# Altium schematic sheet Logic Buffer.SchDoc
size A; SheetNumber: 10; SheetTotal: 12
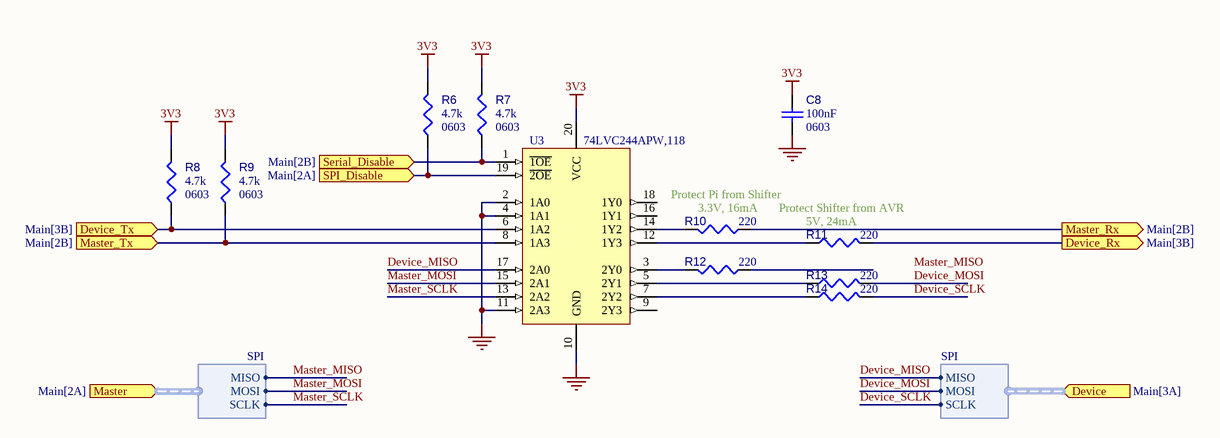
[diagram p0: Logic Buffer.SchDoc]

## Parts
C8  value 100nF  Case/Package: 0603  [CAPC1608X90X40NL10T20]  (hidden comment: Capacitor 100 nF +/-10% 50 V 0603)
R6  value 4.7k  Case/Package: 0603  [RESC1608X55X25ML10T15]  (hidden comment: Resistor 1k +/-1% 0603 100 mW)
R7  value 4.7k  Case/Package: 0603  [RESC1608X55X25ML10T15]  (hidden comment: Resistor 1k +/-1% 0603 100 mW)
R8  value 4.7k  Case/Package: 0603  [RESC1608X55X25ML10T15]  (hidden comment: Resistor 1k +/-1% 0603 100 mW)
R9  value 4.7k  Case/Package: 0603  [RESC1608X55X25ML10T15]  (hidden comment: Resistor 1k +/-1% 0603 100 mW)
R10  value 220  [RESC1608X55X25ML10T15]  (hidden comment: Resistor 1k +/-1% 0603 100 mW)
R11  value 220  [RESC0603(1608)_L]  (hidden comment: Resistor 120R +/-5 % 0603 0.1 W)
R12  value 220  [RESC1608X55X25ML10T15]  (hidden comment: Resistor 1k +/-1% 0603 100 mW)
R13  value 220  [RESC0603(1608)_L]  (hidden comment: Resistor 120R +/-5 % 0603 0.1 W)
R14  value 220  [RESC0603(1608)_L]  (hidden comment: Resistor 120R +/-5 % 0603 0.1 W)
U3  74LVC244APW,118  [SOP65P640X110-20N]

## Ports
Device (in, harness SPI, see Main[3A]), Device_Rx (out, see Main[3B]), Device_Tx (in, see Main[3B]), Master (in, harness SPI, see Main[2A]), Master_Rx (out, see Main[2B]), Master_Tx (in, see Main[2B]), Serial_Disable (in, see Main[2B]), SPI_Disable (in, see Main[2A])

## Harnesses
SPI: MISO, MOSI, SCLK

## Nets
3V3: C8.2 R6.2 R7.2 R8.2 R9.2 U3.20(VCC)
GND: C8.1 U3.2(1A0) U3.4(1A1) U3.10(GND) U3.11(2A3)
Device_MISO: U3.17(2A0) ; port Device.MISO
Device_MOSI: R13.2 ; port Device.MOSI
Device_Rx: R11.2 ; port Device_Rx
Device_SCLK: R14.2 ; port Device.SCLK
Device_Tx: R8.1 U3.6(1A2) ; port Device_Tx
Master_MISO: port Master.MISO
Master_MOSI: U3.15(2A1) ; port Master.MOSI
Master_Rx: R10.1 ; port Master_Rx
Master_SCLK: U3.13(2A2) ; port Master.SCLK
Master_Tx: R9.1 U3.8(1A3) ; port Master_Tx
Serial_Disable: R7.1 U3.1(~{1OE}) ; port Serial_Disable
SPI_Disable: R6.1 U3.19(~{2OE}) ; port SPI_Disable
NetR10_2: R10.2 U3.14(1Y2)
NetR11_1: R11.1 U3.12(1Y3)
NetR12_2: R12.2 U3.3(2Y0)
NetR13_1: R13.1 U3.5(2Y1)
NetR14_1: R14.1 U3.7(2Y2)

Not connected (* = marked no-connect by the designer): R12 1; U3 9(2Y3) 16(1Y1) 18(1Y0)

## Notes on the sheet
- Protect Pi from Shifter
- (near R10) 3.3V, 16mA
- Protect Shifter from AVR
- (near R11) 5V, 24mA
- Labels drawn without touching a wire or pin: Master_MISO

## Library data of the parts
C8 = CMP-001-00017-6: Chip Capacitor, 100 nF, +/- 10%, 50 V, 0603 (1608 Metric); Voltage Rating: 50V; Capacitor Type: Ceramic; Tolerance: 10%; Mounting Technology: SM; Max Operating Temperature: 125°C; RoHS Compliant: True; Pins: 2; Min Operating Temperature: -55°C
R6-R10 R12 = CMP-009-00014-5: Chip Resistor, 1 KOhm, +/-1%, 0.1 W, -55 to 155 degC, 0603 (1608 Metric); Voltage Rating: 50V; Power: 100mW; Tolerance: 1%; Mounting Technology: SM; Pins: 2; Min Operating Temperature: -55°C; RoHS Compliant: True; Max Operating Temperature: 155°C
  R10 R12: Case/Package: 0603
R11 R13 R14 = CMP-009-00176-3: Chip Resistor, 120 Ohms, +/-5 %, 0.1 W, -55 to 155 degC, 0603; Power: 100mW; Tolerance: 5%; Max Operating Temperature: 155°C; Pins: 2; Case/Package: 0603; Min Operating Temperature: -55°C
U3 = CMP-008-000000-3: Octal buffer/line driver; MP: 74LVC244APW-118; Source: 74LVC244APW,118.SchLib; Package: None; Design Item ID: 74LVC244APW,118; Value: *; Pin Count: 20; Availability: Unavailable; Price: None; Component Type: Standard